# EAGLE schematic main (EAGLE 6.5.0)
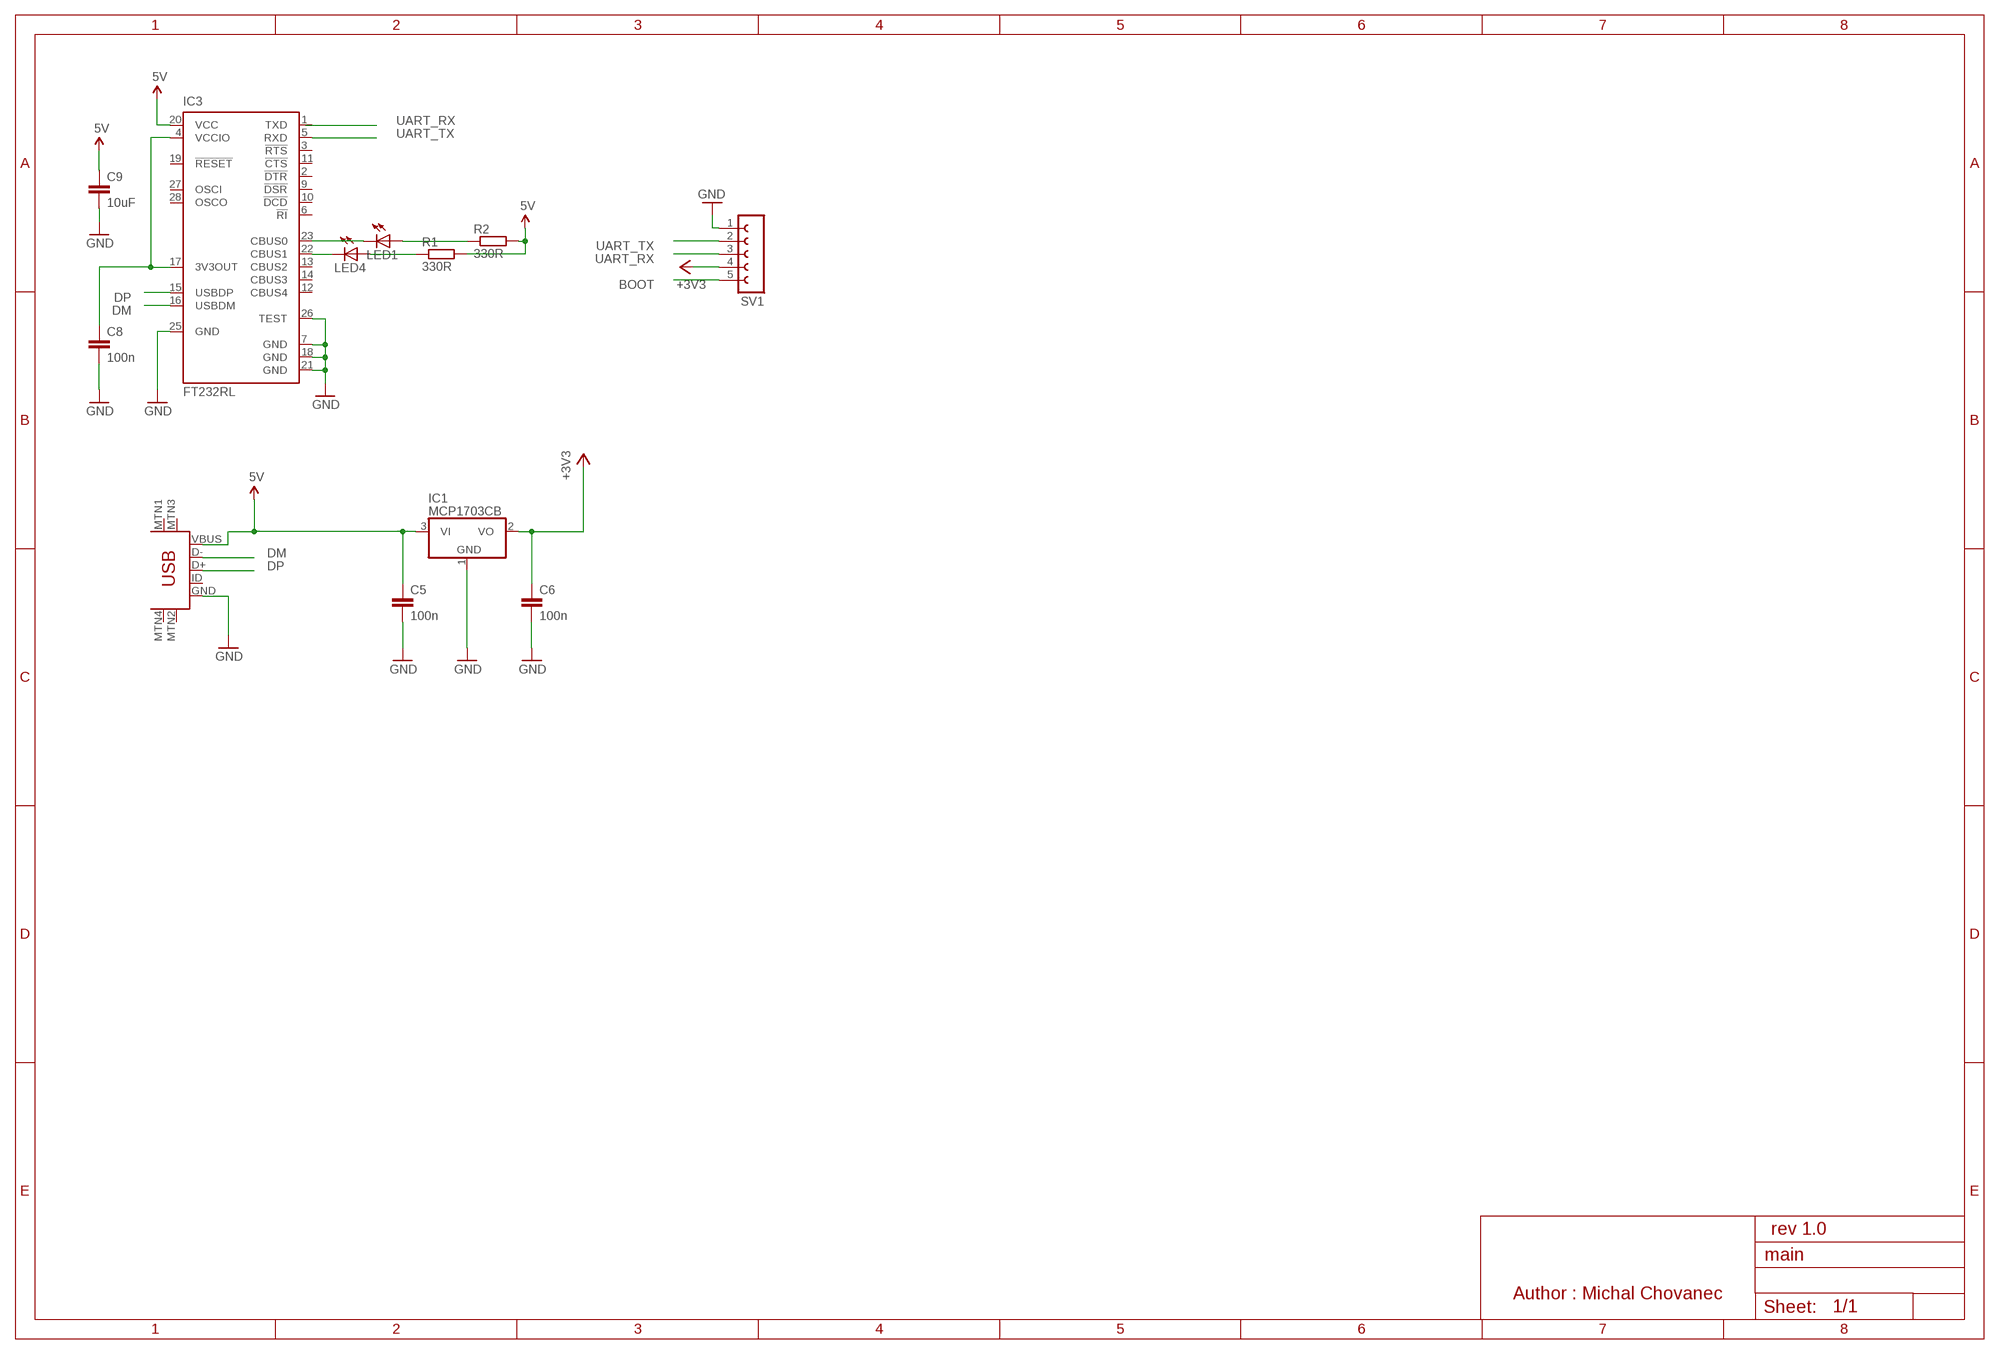
[diagram p0: schematic, sheet 1]

## Parts
C5  100n  C-EUC0805  [C0805]
C6  100n  C-EUC0805  [C0805]
C8  100n  C-EUC0805  [C0805]
C9  10uF  C-EUC0805  [C0805]
IC1  MCP1703CB  [SOT23]
IC3  FT232RL  [SSOP28]
LED1  LEDCHIPLED_1206  [CHIPLED_1206]
LED4  LEDCHIPLED_1206  [CHIPLED_1206]
R1  330R  R-EU_M0805  [M0805]
R2  330R  R-EU_M0805  [M0805]
SV1  FE05-1  [FE05-1]
U$1  USB-MINIB-5PIN  [USB-MINIB]

## Nets
5V: C5.1 C9.1 IC1.3(VI) IC3.20(VCC) R1.2 R2.2 U$1.VBUS
+3V3: C6.1 IC1.2(VO) SV1.4
BOOT: SV1.5
DM: IC3.16(USBDM) U$1.D-
DP: IC3.15(USBDP) U$1.D+
GND: C5.2 C6.2 C8.2 C9.2 IC1.1(GND) IC3.7(GND) IC3.18(GND) IC3.21(GND) IC3.25(GND) IC3.26(TEST) SV1.1 U$1.GND
N$1: IC3.23(CBUS0) LED1.C
N$2: C8.1 IC3.4(VCCIO) IC3.17(3V3OUT)
N$3: IC3.22(CBUS1) LED4.C
N$4: LED4.A R1.1
N$5: LED1.A R2.1
UART_RX: SV1.3
UART_TX: IC3.5(RXD) SV1.2
Unconnected: IC3.1(TXD) IC3.2(!DTR) IC3.3(!RTS) IC3.6(!RI) IC3.9(!DSR) IC3.10(!DCD) IC3.11(!CTS) IC3.12(CBUS4) IC3.13(CBUS2) IC3.14(CBUS3) IC3.19(!RESET) IC3.27(OSCI) IC3.28(OSCO) U$1.ID U$1.MTN1(MTN2) U$1.MTN2(MTN3) U$1.MTN3(MTN1) U$1.MTN4

## Notes on the sheet
- rev 1.0
- Author : Michal Chovanec

## Library data of the parts
C5 C6 C8 C9 = resistor:C-EU: CAPACITOR, European symbol
IC1 = linear:MCP1703: 250 mA, 16V, Low Quiescent Current LDO Regulator Source: http://ww1.microchip.com/downloads/en/DeviceDoc/22049b.pdf
IC3 = ftdichip:FT232R: Source: http://www.ftdichip.com/Documents/DataSheets/DS_FT232R_v104.pdf; MPN: FT232RL; OC_FARNELL: 1146032; OC_NEWARK: 91K9918
LED1 LED4 = led:LED: LED OSRAM: - CHIPLED LG R971, LG N971, LY N971, LG Q971, LY Q971, LO R971, LY R971 LH N974, LH R974 LS Q976, LO Q976, LY Q976 LO Q996 - Hyper CHIPLED LW Q18S LB Q993, LB Q99A, LB R99A - SideLED LS A670, LO A670, LY A670, LG A670, LP A670 LB A673, LV A673, LT A673, LW A673 LH A674 LY A675 LS A676, LA A676, LO A676, LY A676, LW A676 LS A679, LY A679, LG A679 - Hyper Micro SIDELED® LS Y876, LA Y876, LO Y876, LY Y876 LT Y87S - SmartLED LW L88C, LW L88S LB L89C, LB L89S, LG L890 LS L89K, LO L89K, LY L89K LS L896, LA L896, LO L896, LY L896 - TOPLED LS T670, LO T670, LY T670, LG T670, LP T670 LSG T670, LSP T670, LSY T670, LOP T670, LYG T670 LG T671, LOG T671, LSG T671 LB T673, LV T673, LT T673, LW T673 LH T674 LS T676, LA T676, LO T676, LY T676, LB T676, LH T676, LSB T676, LW T676 LB T67C, LV T67C, LT T67C, LS T67K, LO T67K, LY T67K, LW E67C LS E67B, LA E67B, LO E67B, LY E67B, LB E67C, LV E67C, LT E67C LW T67C LS T679, LY T679, LG T679 LS T770, LO T770, LY T770, LG T770, LP T770 LB T773, LV T773, LT T773, LW T773 LH T774 LS E675, LA E675, LY E675, LS T675 LS T776, LA T776, LO T776, LY T776, LB T776 LHGB T686 LT T68C, LB T68C - Hyper Mini TOPLED® LB M676 - Mini TOPLED Santana® LG M470 LS M47K, LO M47K, LY M47K Source: http://www.osram.convergy.de LUXEON: - LUMILED® LXK2-PW12-R00, LXK2-PW12-S00, LXK2-PW14-U00, LXK2-PW14-V00 LXK2-PM12-R00, LXK2-PM12-S00, LXK2-PM14-U00 LXK2-PE12-Q00, LXK2-PE12-R00, LXK2-PE12-S00, LXK2-PE14-T00, LXK2-PE14-U00 LXK2-PB12-K00, LXK2-PB12-L00, LXK2-PB12-M00, LXK2-PB14-N00, LXK2-PB14-P00, LXK2-PB14-Q00 LXK2-PR12-L00, LXK2-PR12-M00, LXK2-PR14-Q00, LXK2-PR14-R00 LXK2-PD12-Q00, LXK2-PD12-R00, LXK2-PD12-S00 LXK2-PH12-R00, LXK2-PH12-S00 LXK2-PL12-P00, LXK2-PL12-Q00, LXK2-PL12-R00 Source: www.luxeon.com KINGBRIGHT: KA-3528ASYC Source: www.kingbright.com
R1 R2 = resistor:R-EU_: RESISTOR, European symbol
SV1 = con-lsta:FE05-1: FEMALE HEADER; OC_FARNELL: unknown; OC_NEWARK: unknown
U$1 = SparkFun:USB-MINIB: Mini-USB "B" connector with 5th pin broken out. Created new symbol breaking out 5th "ID" pin in mini/micro USB connector spec. See: http://en.wikipedia.org/wiki/Mini_usb#Cables. Uses same footprint as 4-pin symbol. Also added pins to connect to mounting / shield pads if required (probably not generally needed as signals aren't shielded once they leave the connector).